# Altium schematic sheet isolated_usb_single.SchDoc
size A4 portrait
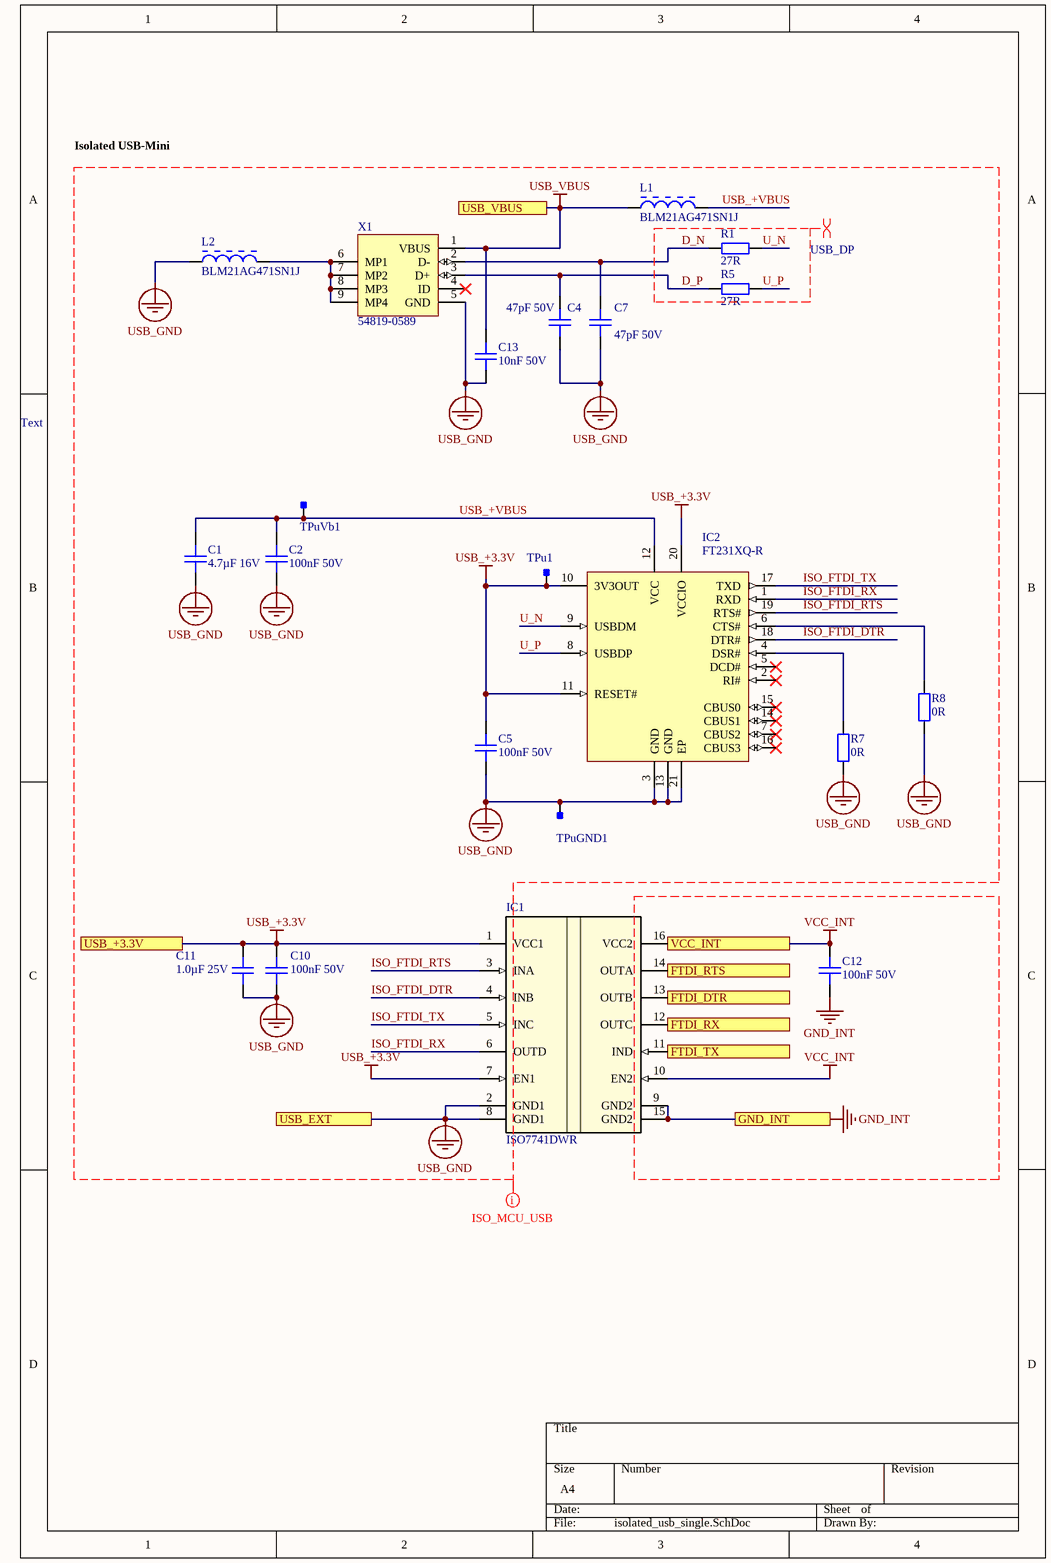
[diagram p0: isolated_usb_single.SchDoc]

## Parts
C1  4.7µF 16V  [0805C]
C2  100nF 50V  [0603C]
C4  47pF 50V  [0402C]
C5  100nF 50V  [0603C]
C7  47pF 50V  [0402C]
C10  100nF 50V  [0603C]
C11  1.0µF 25V  [0603C]
C12  100nF 50V  [0603C]
C13  10nF 50V  [0603C]
IC1  ISO7741DWR  [DW0016B_N]
IC2  FT231XQ-R  [QFN-20_N]
L1  BLM21AG471SN1J  [MURA-BLM21-H1-CHIP-2_V]
L2  BLM21AG471SN1J  [MURA-BLM21-H1-CHIP-2_V]
R1  27R  [0603R]
R5  27R  [0603R]
R7  0R  [0603R]
R8  0R  [0603R]
TPu1  Testpoint_Square  [Testpoint_S1]  (value not drawn)  (no BOM)
TPuGND1  Testpoint_Square  [Testpoint_S1]  (value not drawn)  (no BOM)
TPuVb1  Testpoint_Square  [Testpoint_S1]  (value not drawn)  (no BOM)
X1  54819-0589  [54819-0589]

## Ports
FTDI_DTR (out), FTDI_RTS (out), FTDI_RX (out), FTDI_TX (in), GND_INT, USB_+3.3V, USB_EXT, USB_VBUS, VCC_INT

## Nets
GND_INT: C12.2 IC1.9(GND2) IC1.15(GND2) ; port GND_INT
USB_+3.3V: C5.1 C10.1 C11.2 IC1.1(VCC1) IC1.7(EN1) IC2.10(3V3OUT) IC2.11(RESET#) IC2.20(VCCIO) TPu1.1 ; port USB_+3.3V
USB_GND: C1.2 C2.2 C4.1 C5.2 C7.1 C10.2 C11.1 C13.2 IC1.2(GND1) IC1.8(GND1) IC2.3(GND) IC2.13(GND) IC2.21(EP) L2.1 R7.2 R8.2 TPuGND1.1 X1.5(GND) ; port USB_EXT
USB_VBUS: C13.1 L1.1 X1.1(VBUS) ; port USB_VBUS
VCC_INT: C12.1 IC1.10(EN2) IC1.16(VCC2) ; port VCC_INT
D_N: C7.2 R1.1 X1.2(D-)
D_P: C4.2 R5.1 X1.3(D+)
FTDI_DTR: IC1.13(OUTB) ; port FTDI_DTR
FTDI_RTS: IC1.14(OUTA) ; port FTDI_RTS
FTDI_RX: IC1.12(OUTC) ; port FTDI_RX
FTDI_TX: IC1.11(IND) ; port FTDI_TX
ISO_FTDI_DTR: IC1.4(INB) IC2.18(DTR#)
ISO_FTDI_RTS: IC1.3(INA) IC2.19(RTS#)
ISO_FTDI_RX: IC1.6(OUTD) IC2.1(RXD)
ISO_FTDI_TX: IC1.5(INC) IC2.17(TXD)
U_N: IC2.9(USBDM) R1.2
U_P: IC2.8(USBDP) R5.2
USB_+VBUS: C1.1 C2.1 IC2.12(VCC) L1.2 TPuVb1.1
NetIC2_4: IC2.4(DSR#) R7.1
NetIC2_6: IC2.6(CTS#) R8.1
NetL2_2: L2.2 X1.6(MP1) X1.7(MP2) X1.8(MP3) X1.9(MP4)

Not connected (* = marked no-connect by the designer): IC2 2(RI#)* 5(DCD#)* 7(CBUS2)* 14(CBUS1)* 15(CBUS0)* 16(CBUS3)*; X1 4(ID)*

## Layout directives
net class ISO_MCU_USB: D_N, D_P, ISO_FTDI_DTR, ISO_FTDI_RTS, ISO_FTDI_RX, ISO_FTDI_TX, U_N, U_P, USB_+3.3V, USB_+VBUS, USB_GND, USB_VBUS
differential pair; differential pair class USB_DP: D_N, D_P, U_N, U_P

## Notes on the sheet
- Isolated USB-Mini
- Text

## Library data of the parts
C1 = gen_C_ceramic_4u7_16V_X7R_0805: Ceramic, 4.7µF, ±10%, 16V, X7R, –55 to 125°C, 0805 (2012),RoHS, Automotive; Part Number: GCJ21BR71C475KA01; Manufacturer: Murata; Capacitance: 4u7; Case EIA: 0805; Case Metric: 2012; AVT Set: x; Automotive Qualified: True; PnP Package: C_0805_10; PnP Value: 4.7µF/16V/X7R; Rated Voltage: 16V; Dielectric: X7R; Supplier 1: Digi-Key; Supplier Part Number 1: 490-10557-1-ND; Height - Seated (Max): 1.25mm; Mounting Type: SurfaceMount,MLCC; Operating Temperature: –55 to 125°C; Series: GCJ; Tolerance: ±10%; Manufacturer_Part_Number: GCJ21BR71C475KA01
C2 C5 C10 C12 = gen_C_ceramic_100n_50V_X7R_0603: Ceramic, 100nF, ±10%, 50V, X7R, –55 to 125°C, 0603 (1608),RoHS, Automotive; Part Number: GCJ188R71H104KA12; Manufacturer: Murata; Capacitance: 100n; Case EIA: 0603; Case Metric: 1608; PnP Package: C_0603_10; PnP Value: 100nF/50V/X7R; PnP equipped: x; Automotive Qualified: True; Rated Voltage: 50V; Dielectric: X7R; Supplier 1: Digi-Key; Supplier Part Number 1: 490-5798-1-ND; Height - Seated (Max): 0.8mm; Mounting Type: SurfaceMount,MLCC; Operating Temperature: –55 to 125°C; Series: GCJ; Tolerance: ±10%; Manufacturer_Part_Number: GCJ188R71H104KA12
C4 C7 = gen_C_ceramic_47p_50V_C0G_0402: Ceramic, 47pF, ±5%, 50V, C0G, 25 to 125°C, 0402 (1005),RoHS, Automotive; Part Number: GCM1555C1H470JA16#; Manufacturer: Murata; Capacitance: 47; Case EIA: 0402; Case Metric: 1005; Automotive Qualified: True; PnP Package: C_0402_10; PnP Value: 47pF/50V/X7R; Rated Voltage: 50V; Dielectric: C0G; Supplier 1: Digi-Key; Supplier Part Number 1: 490-10670-1-ND; Height - Seated (Max): 0.5mm; Mounting Type: SurfaceMount,MLCC; Operating Temperature: -55 to 125°C; Series: GCM; Tolerance: ±5%; Manufacturer_Part_Number: GCM1555C1H470JA16#
C11 = gen_C_ceramic_1u_25V_X7R_0603: Ceramic, 1.0µF, ±10%, 25V, X7R, –55 to 125°C, 0603 (1608),RoHS, Automotive; Part Number: GCJ188R71E105KA01; Manufacturer: Murata; Case EIA: 0603; Case Metric: 1608; Capacitance: 1µF; Automotive Qualified: True; PnP Package: C_0603_10; PnP Value: 1.0µF/25V/X7R; Dielectric: X7R; Rated Voltage: 25V; Height - Seated (Max): 0.8mm; Mounting Type: SurfaceMount,MLCC; Operating Temperature: –55 to 125°C; Series: GCJ; Tolerance: ±10%; Manufacturer_Part_Number: GCJ188R71E105KA01; Supplier 1: Digi-Key; Supplier Part Number 1: 490-14409-1-ND
C13 = gen_C_ceramic_10n_50V_X7R_0603: Ceramic, 10nF, ±10%, 50V, X7R, –55 to 125°C, 0603 (1608),RoHS, Automotive; Part Number: GCJ188R71H102KA01; Manufacturer: Murata; Capacitance: 10n; Case EIA: 0603; Case Metric: 1608; PnP Package: C_0603_10; PnP Value: 10nF/50V/X7R; Automotive Qualified: True; Rated Voltage: 50V; Dielectric: X7R; Supplier 1: Digi-Key; Supplier Part Number 1: 490-5768-1-ND; Height - Seated (Max): 0.8mm; Mounting Type: SurfaceMount,MLCC; Operating Temperature: –55 to 125°C; Series: GCJ; Tolerance: ±10%; Manufacturer_Part_Number: GCJ188R71H102KA01
IC1 = ISO7741DWR: Imported; Manufacturer: Texas Instruments; PartNumber: ISO7741DWR; RefDes: RefDes; TYPE: TYPE; Value: Value; Part Number: ISO7741DWR
IC2 = CMP-0248-00001-2: USB to Full-Handshake UART Interface Chip, UHCI/OHCI/EHCI Compatible, USB 2.0 Compatible, -40 to +85 degC, 20-Pin QFN, Pb-Free, Tape and Reel; Manufacturer: FTDI; PartNumber: FT231XQ-R; ComponentLink3Description: FT231X Product Page; Code_JEDEC: MO-220WGGD-1; DatasheetVersion: ver 1.2, Feb-2013; ComponentLink1URL: http://www.ftdichip.com/; PackageDescription: 20-Pin Quad Flat No-Lead, 4 x 4 mm Body, 0.5 mm Pitch; ComponentLink2URL: http://www.ftdichip.com/Support/Documents/DataSheets/ICs/DS_FT231X.pdf; ComponentLink3URL: www.ftdichip.com/Products/ICs/FT231X.html; PackageVersion: Feb-13; PackageReference: QFN-20; RevisionNote: DatasheetVersion updated to 1.2 Feb-2013; ComponentLink2Description: Datasheet; ComponentLink1Description: Manufacturer URL
L1 L2 = C5133952-28DE-41F1-874F-4A9C3E40D898: Chip Ferrite Bead for General Signal lines, 470 Ohm, 700 mA, -55 to 125 degC, 2 x 1.25 x 1.05 mm SMD, Tape and Reel; Manufacturer: Murata; DC Resistance: 0.19 Ohm Max.; Impedance (at 100 MHz): 470 Ohm +/- 25%; Rated Current: 700 mA; ComponentLink1URL: http://www.murata.com/; Packing: Tape and Reel; PackageDescription: 2-Pin Chip, Body 2 x 1.25 mm; ComponentLink3Description: Package Specification; Operating Temperature Range: -55 to 125 degC; ComponentLink1Description: Manufacturer URL; PartNumber: BLM21AG471SN1J; DatasheetVersion: 08/2013; Mounting Technology: Surface Mount; ComponentLink2URL: http://www.murata.com/products/catalog/pdf/c31e.pdf; ComponentLink3URL: http://www.murata.com/products/catalog/pdf/c31e.pdf; ComponentLink2Description: Datasheet; PackageReference: BLM21_H1050-2; Part Number: BLM21AG471SN1J
R1 R5 = gen_R_27R_0603: SMD Resistor 27R 0603; Tolerance: 1%; Power: 0.1W; Case EIA: 0603; Case Metric: 1608; Maximum Working Voltage: 75V; PnP Package: R_0603; Automotive Qualified: False; Part Number: gen_R_27R_0603; Operating Temperature: -55°C - +155°C; Resistance: 27R; Series: E24; PnP Value: 27R; Supplier 1: Farnell; Supplier Part Number 1: 2059559
R7 R8 = gen_R_0R_0603: SMD Resistor 0R 0603; Power: 0.1W; Case EIA: 0603; Case Metric: 1608; PnP Package: R_0603; Maximum Working Voltage: 75V; Automotive Qualified: False; Part Number: gen_R_0R_0603; Operating Temperature: -55°C - +155°C; Resistance: 0R; Series: Jumper; PnP Value: 0R; Supplier 1: Farnell; Supplier Part Number 1: 2073345
TPu1 TPuGND1 TPuVb1 = Testpoint_Square: Testpoint, square; Part Number: Testpoint_Square
X1 = MOLX-67503-1020: USB, MINI, SMD, RA KME04-USBMU03A01; Manufacturer: Molex; ComponentLink1URL: http://www.molex.com/; PartNumber: 54819-0589; Mounting Technology: Surface Mount; ComponentLink1Description: Manufacturer URL; Terminal Pitch: 0.8 mm; DatasheetVersion: Rev F, 06/2009; ComponentLink2Description: Datasheet; PackageDescription: Mini USB Connector, TH, Righer Angle; ComponentLink2URL: http://www.molex.com/pdm_docs/sd/675031020_sd.pdf; PackageReference: 54819-0589